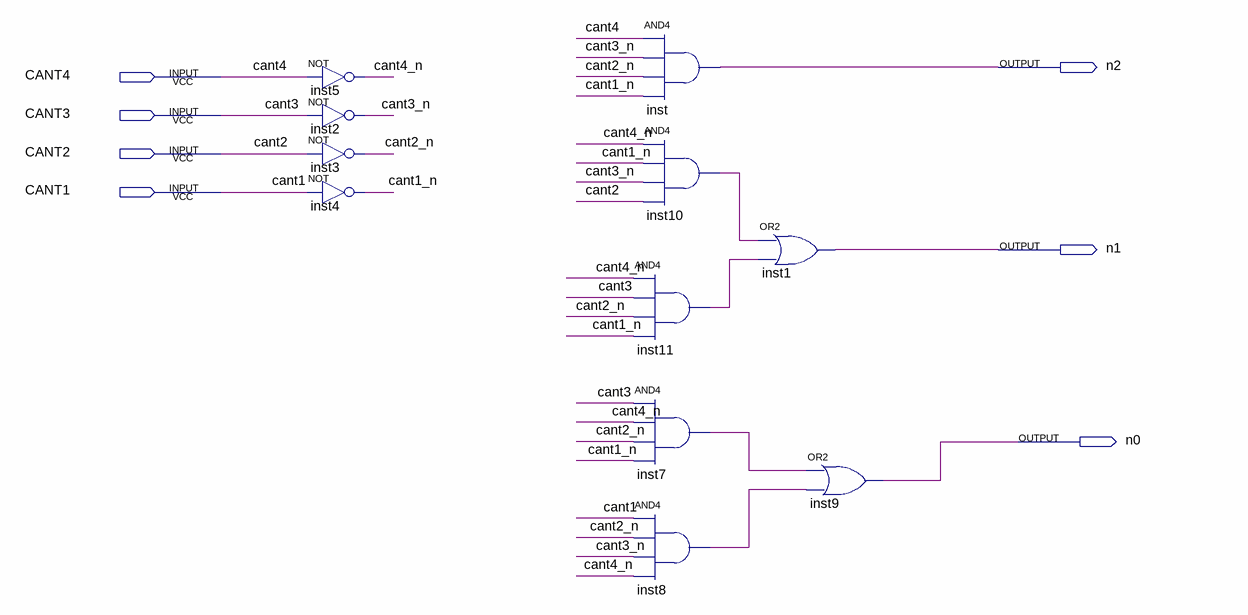
[diagram p0: schematic sheet]
// Quartus schematic Cambiar_Cant_Numero.bdf as structural Verilog: 11 symbols, 7 pins
module Cambiar_Cant_Numero (
  input  CANT4,
  input  CANT3,
  input  CANT2,
  input  CANT1,
  output n2,
  output n1,
  output n0
);

  wire cant1_n, cant2_n, cant3_n, cant4_n, inst7_out, inst8_out, inst10_out, inst11_out;

  not inst5 (cant4_n, CANT4);
  not inst2 (cant3_n, CANT3);
  not inst3 (cant2_n, CANT2);
  not inst4 (cant1_n, CANT1);
  and inst (n2, CANT4, cant3_n, cant2_n, cant1_n);
  and inst10 (inst10_out, cant4_n, cant1_n, cant3_n, CANT2);
  and inst11 (inst11_out, cant4_n, CANT3, cant2_n, cant1_n);
  and inst7 (inst7_out, CANT3, cant4_n, cant2_n, cant1_n);
  and inst8 (inst8_out, CANT1, cant2_n, cant3_n, cant4_n);
  or inst1 (n1, inst10_out, inst11_out);
  or inst9 (n0, inst7_out, inst8_out);
endmodule
